# Altium project 电源模块V5.PrjPcb
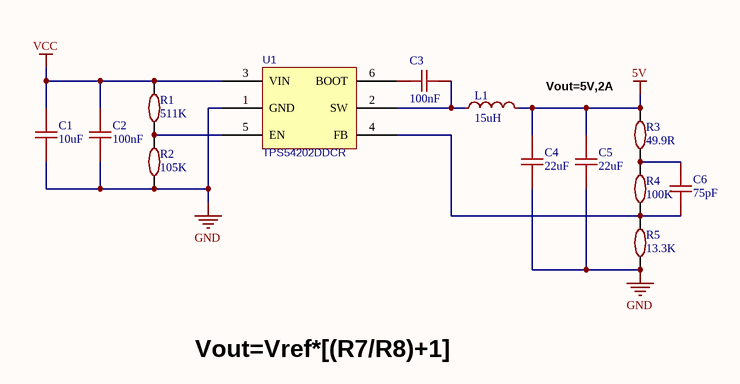
[diagram p0: Sheet1.SchDoc]
1 sheet, 13 parts. Net scope: global (net labels, ports and power ports of the same name join across sheets).
Board file: PCB1.PcbDoc

## Sheet Sheet1.SchDoc
size A4; SheetNumber: 1; SheetTotal: 1

### Parts
C1  10uF  [C_0603]
C2  100nF  [C_0603]
C3  100nF  [C_0603]
C4  22uF  [C_0603]
C5  22uF  [C_0603]
C6  75pF  [C_0603]
L1  15uH  [L-SMD-0630]
R1  511K  [R_0603]
R2  105K  [R_0603]
R3  49.9R  [R_0603]
R4  100K  [R_0603]
R5  13.3K  [R_0603]
U1  TPS54202DDCR  [SOT23-6L]

### Nets
5V: C4.2 C5.2 L1.2 R3.2
GND: C1.1 C2.1 C4.1 C5.1 R2.1 R5.1 U1.1(GND)
VCC: C1.2 C2.2 R1.2 U1.3(VIN)
NetC3_1: C3.1 L1.1 U1.2(SW)
NetC3_2: C3.2 U1.6(BOOT)
NetC6_1: C6.1 R4.1 R5.2 U1.4(FB)
NetC6_2: C6.2 R3.1 R4.2
NetR1_1: R1.1 R2.2 U1.5(EN)

### Notes on the sheet
- Vout=5V,2A
- Vout=Vref*[(R7/R8)+1]

### Library data of the parts
C1-C6 = C_0603: 4.7nf-4.7uf
L1 = L_33uH_0603: 一体成型电感
R1-R5 = R_0603
U1 = TPS54202DDCR: BOM_Manufacturer: Texas Instruments; Contributor: LCSC; BOM_Supplier: LCSC; BOM_Supplier Part: C191884; BOM_Manufacturer Part: TPS54202DDCR; BOM_JLCPCB Part Class: Extended Part; spicePre: U; spiceSymbolName: TPS54202DDCR